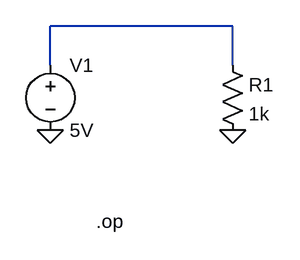
[diagram p0: schematic simple2.asc]
simple2.asc, the LTspice schematic file:
Version 4
SHEET 1 880 680
WIRE 288 208 64 208
WIRE 64 256 64 208
WIRE 288 256 288 208
FLAG 64 336 0
FLAG 288 336 0
SYMBOL voltage 64 240 R0
SYMATTR InstName V1
SYMATTR Value 5V
SYMBOL res 272 240 R0
SYMATTR InstName R1
SYMATTR Value 1k
TEXT 120 448 Left 2 !.op

The netlist it stands for:
* simple2.asc
V1 N001 0 5V
R1 N001 0 1k
.op
.backanno
.end